# Altium schematic sheet COM_GSM.SchDoc
size 330 x 241 mm; SheetNumber: 6; SheetTotal: 8
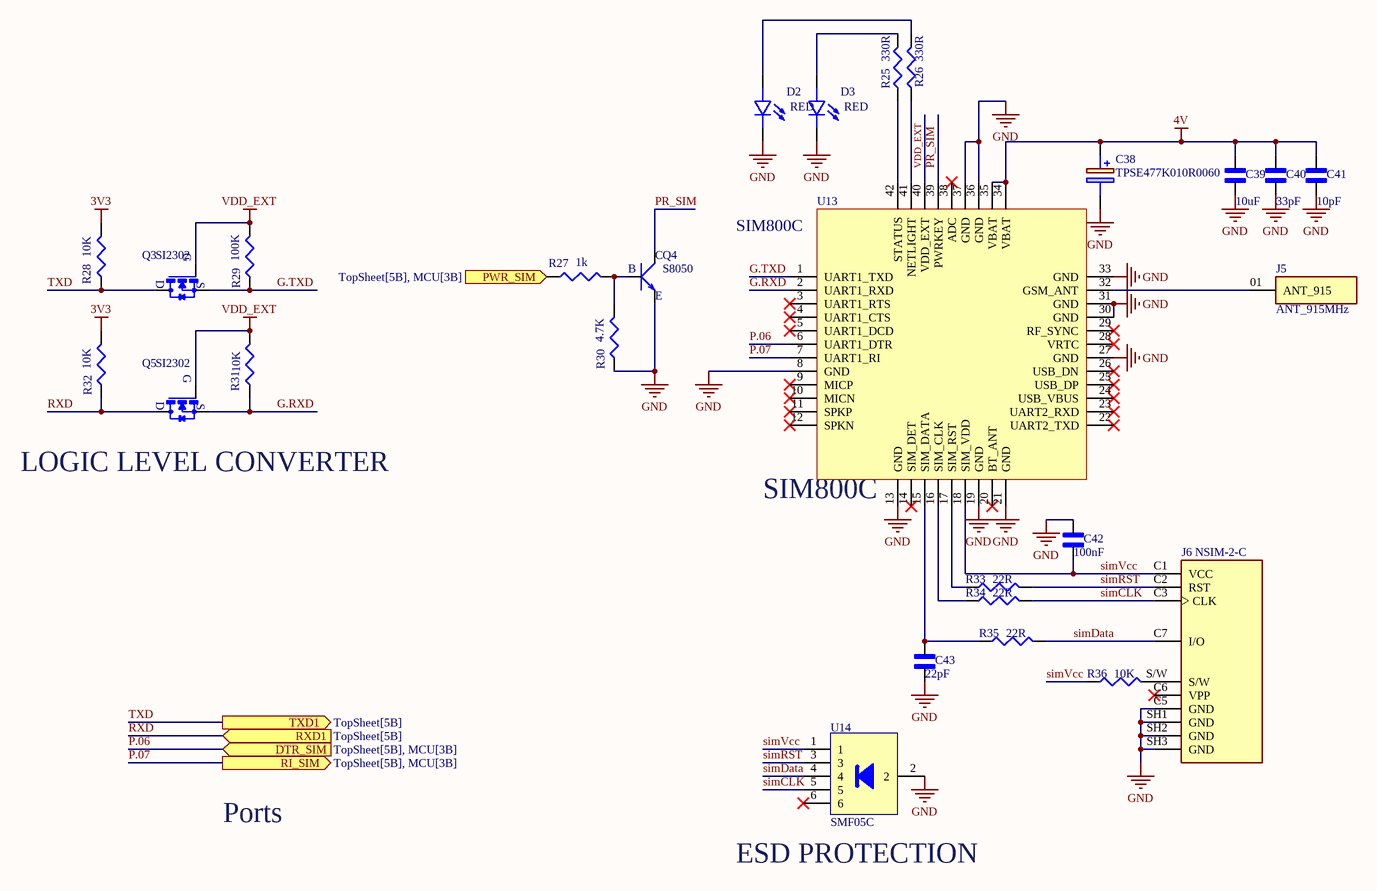
[diagram p0: COM_GSM.SchDoc]

## Parts
C38  TPSE477K010R0060  [CAPPM7344X430N]
C39  10uF  [C0603]
C40  33pF  [C0603]
C41  10pF  [C0603]
C42  100nF  [C0402]
C43  22pF  [C0402]
D2  RED  [0603D-B]
D3  RED  [0603D-B]
J5  ANT_915MHz  [SAMTEC_HTSW-101-24-LM-S]
J6  NSIM-2-C  [CUI_NSIM-2-C]
Q3  SI2302  [SOT23]
Q4  S8050  [SOT95P237X112-3N]
Q5  SI2302  [SOT23]
R25  330R  [R0603]
R26  330R  [R0603]
R27  1k  [R0603]
R28  10K  [R0603]
R29  100K  [R0603]
R30  4.7K  [R0603]
R31  10K  [R0603]
R32  10K  [R0603]
R33  22R  [R0402]
R34  22R  [R0402]
R35  22R  [R0402]
R36  10K  [R0402]
U13  DeviceName: SIM800C  [SMD]  (hidden comment: SIM800C GSM/GPRS Module)
U14  SOT363  [SOT363]  (value not drawn)

## Ports
DTR_SIM (in, see TopSheet[5B], MCU[3B]), PWR_SIM (in, see TopSheet[5B], MCU[3B]), RI_SIM (out, see TopSheet[5B], MCU[3B]), RXD1 (in, see TopSheet[5B]), TXD1 (out, see TopSheet[5B])

## Nets
3V3: R28.2 R32.2
4V: C38.1(+) C39.2 C40.2 C41.2 U13.34(VBAT) U13.35(VBAT)
GND: C38.2(-) C39.1 C40.1 C41.1 C42.2 C43.1 D2.2(NEG) D3.2(NEG) J6.C5(GND) J6.SH1(GND) J6.SH2(GND) J6.SH3(GND) Q4.2(E) R30.1 U13.8(GND) U13.13(GND) U13.19(GND) U13.21(GND) U13.27(GND) U13.30(GND) U13.31(GND) U13.33(GND) U13.36(GND) U13.37(GND) U14.2
VDD_EXT: Q3.1(G) Q5.1(G) R29.2 R31.2 U13.40(VDD_EXT)
G.RXD: Q5.2(S) R31.1 U13.2(UART1_RXD)
G.TXD: Q3.2(S) R29.1 U13.1(UART1_TXD)
P.06: U13.6(UART1_DTR) ; port DTR_SIM
P.07: U13.7(UART1_RI) ; port RI_SIM
PR_SIM: Q4.3(C) U13.39(PWRKEY)
PWR_SIM: R27.1 ; port PWR_SIM
RXD: Q5.3(D) R32.1 ; port RXD1
simCLK: J6.C3(CLK) R34.2 U14.5
simData: J6.C7(I/O) R35.2 U14.4
simRST: J6.C2(RST) R33.2 U14.3
simVcc: C42.1 J6.C1(VCC) R36.1 U13.18(SIM_VDD) U14.1
TXD: Q3.3(D) R28.1 ; port TXD1
NetC43_2: C43.2 R35.1 U13.15(SIM_DATA)
NetD2_1: D2.1(POS) R26.2
NetD3_1: D3.1(POS) R25.2
NetJ5_01: J5.01(ANT_915) U13.32(GSM_ANT)
NetJ6_S/W: J6.S/W R36.2
NetQ4_1: Q4.1(B) R27.2 R30.2
NetR25_1: R25.1 U13.42(STATUS)
NetR26_1: R26.1 U13.41(NETLIGHT)
NetR33_1: R33.1 U13.17(SIM_RST)
NetR34_1: R34.1 U13.16(SIM_CLK)

Not connected (* = marked no-connect by the designer): J6 C6(VPP)*; U13 3(UART1_RTS)* 4(UART1_CTS)* 5(UART1_DCD)* 9(MICP)* 10(MICN)* 11(SPKP)* 12(SPKN)* 14(SIM_DET)* 20(BT_ANT)* 22(UART2_TXD)* 23(UART2_RXD)* 24(USB_VBUS)* 25(USB_DP)* 26(USB_DN)* 28(VRTC)* 29(RF_SYNC)* 38(ADC)*; U14 6*

## Notes on the sheet
- (near Q5) LOGIC LEVEL CONVERTER
- (near U13) SIM800C
- Ports
- (near U14) ESD PROTECTION
- (near U14) SMF05C

## Library data of the parts
C38 = TPSE477K010R0060: Capacitor tantalum TPS 2717 470uF 10V AVX +/-10% 470uF 10 V dc SMD Tantalum Electrolytic Capacitor, 7343-43 ESR 60m +125C TPS; Manufacturer_Name: Kyocera AVX; Geometry.Height: 4.3mm; Mouser Part Number: 581-TPSE477K010R0060; Mouser Price/Stock: https://www.mouser.com/Search/Refine.aspx?Keyword=581-TPSE477K010R0060; Manufacturer_Part_Number: TPSE477K010R0060; Datasheet Link: https://componentsearchengine.com/Datasheets/1/TPSE477K010R0060.pdf
C39-C43 = Capacitor non polar: This Non-Polarized Capacitor Design Library provides accurate schematic symbols and IPC-compliant PCB footprints for standard non-polarized capacitors, including MLCCs (ceramic capacitors) in common SMD sizes like 0402, 0603, 0805,1206 and 1210.; MF: Murata; MP: GJM1555C1HR10BB01J; SnapEDA_Link: https://www.snapeda.com/parts/GJM1555C1HR10BB01J/Murata/view-part/?ref=snap; Package: 1005 Taiyo Yuden; Value: *; Check_prices: https://www.snapeda.com/parts/GJM1555C1HR10BB01J/Murata/view-part/?ref=eda
D2 D3 = LED: Generic LED SMD; MF: Osram; MP: LHN974 RED LED 1206; SnapEDA_Link: https://www.snapeda.com/parts/LHN974%20RED%20LED%201206/Osram/view-part/?ref=snap; Package: None; Value: *; Check_prices: https://www.snapeda.com/parts/LHN974%20RED%20LED%201206/Osram/view-part/?ref=eda
J5 = ANT_915MHz: MP: HTSW-101-24-LM-S; Availability: Unavailable; Package: None; Price: None; Value: *
J6 = NSIM-2-C: Nano SIM Card Connectors, 6 Positions, Connector, Hinged, Surface Mount, 1.4 mm Height Above Board, Gold Flash; MF: Same Sky; SnapEDA_Link: https://www.snapeda.com/parts/NSIM-2-C/Same+Sky/view-part/?ref=snap; Package: None; Value: *; MP: NSIM-2-C; Check_prices: https://www.snapeda.com/parts/NSIM-2-C/Same+Sky/view-part/?ref=eda
Q3 Q5 = SI2302: N-Channel 20 V 2.6A (Ta) 710mW (Ta) Surface Mount SOT-23-3 (TO-236); MF: Vishay Siliconix; SnapEDA_Link: https://www.snapeda.com/parts/SI2302/Vishay/view-part/?ref=snap; Package: SOT-23-3 Vishay Siliconix; Value: *; MP: SI2302; Check_prices: https://www.snapeda.com/parts/SI2302/Vishay/view-part/?ref=eda
Q4 = S8050: Bipolar (BJT) Transistor NPN 25 V 500 mA 150MHz 300 mW Surface Mount SOT-23; MF: UMW; Purchase-URL: https://pricing.snapeda.com/search/part/S8050/?ref=eda; Check_prices: https://www.snapeda.com/parts/S8050/Umwelt+Sensor+Teknik/view-part/?ref=eda; SnapEDA_Link: https://www.snapeda.com/parts/S8050/Umwelt+Sensor+Teknik/view-part/?ref=snap; Price: None; Availability: In Stock; Package: None; MP: S8050; Value: *
R25-R36 = Resistor: This Library provides a comprehensive set of schematic symbols and PCB footprints for standard resistor packages (e.g., 0402, 0603, 0805, 1206).
U13 = GSM_SIM800C: GateName_1: G$1; SymbolName_1: SIM900_LITERAL; DeviceSetName: GSM_SIM900_LITERAL; LibraryName: microbuilder; Package: SIM900_SMT; Parameter 1: *
U14 = SMF05C: GateName_1: G$1; SymbolName_1: TVSARRAY_5LANE; LibraryName: microbuilder; DeviceSetName: TVSARRAY_5LANE; Package: SOT363